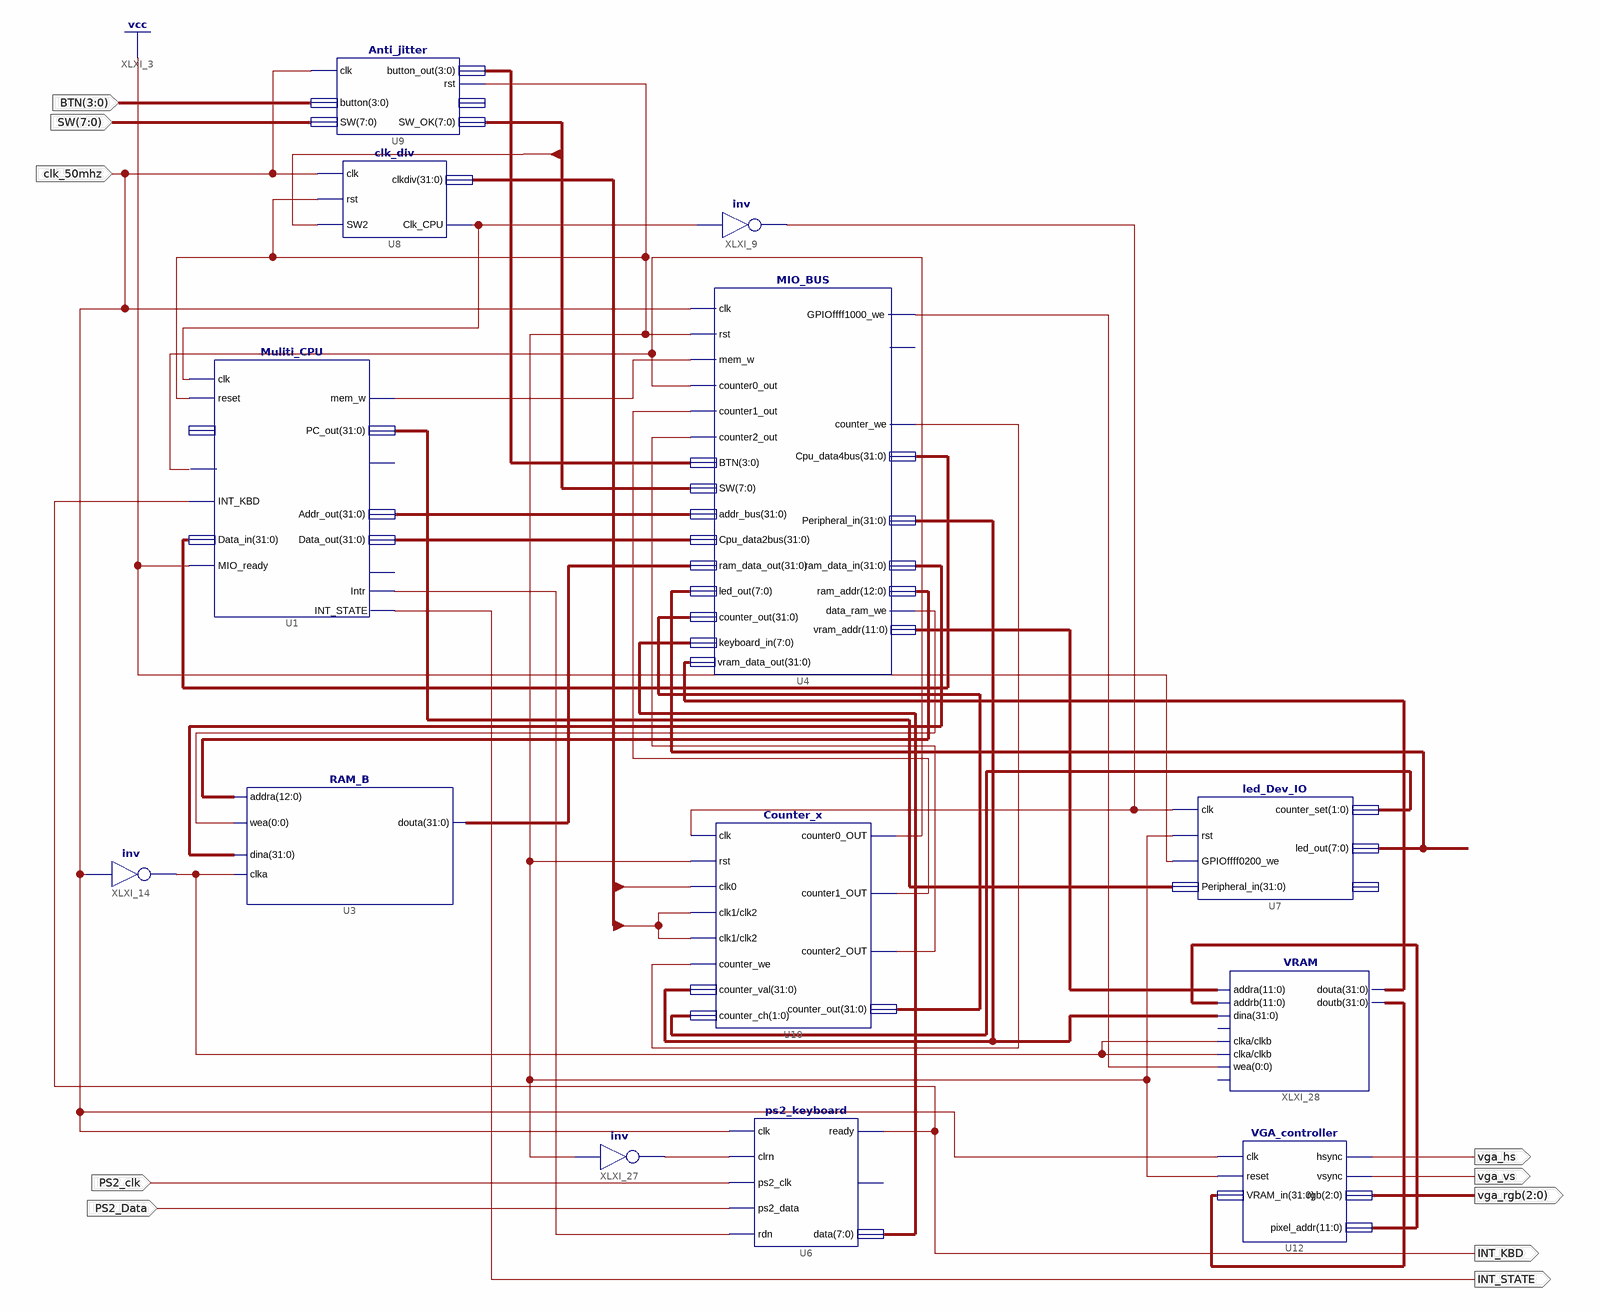
[diagram p0: schematic sheet 1]
// Xilinx ISE schematic Top_SCPU_IOBUS_App.sch (spartan3e) as structural Verilog: 13 symbols, 10 ports
module Top_SCPU_IOBUS_App (
  input  [3:0] BTN,
  input  [7:0] SW,
  input  clk_50mhz,
  input  PS2_clk,
  input  PS2_Data,
  output vga_hs,
  output vga_vs,
  output [2:0] vga_rgb,
  output INT_STATE,
  output INT_KBD
);

  wire Clk_CPU, clka, counter1_out, counter2_out, counter_we, GPIOffff1000_we, INT_CNT, intr, mem_w, rst,
       XLXN_55, XLXN_193;
  wire [0:0] XLXN_191;
  wire [1:0] counter_set;
  wire [3:0] button_out;
  wire [7:0] keyboard_in, LED, SW_OK;
  wire [11:0] vram_addr, vram_addr_ctr;
  wire [12:0] ram_addr;
  wire [31:0] Addr_out, clkdiv, counter_out, Cpu_data2bus, Data_in, PC_out, Peripheral_in, ram_data_in,
       ram_data_out, vram_data_out, vram_to_ctr;

  Anti_jitter U9 (
    .clk(clk_50mhz), .SW(SW), .button_out(button_out), .SW_OK(SW_OK), .button(BTN), .rst(rst));  // open: button_pulse
  clk_div U8 (.clk(clk_50mhz), .rst(rst), .SW2(SW_OK[2]), .clkdiv(clkdiv), .Clk_CPU(Clk_CPU));
  Counter_x U10 (
    .clk(XLXN_55), .rst(rst), .clk0(clkdiv[7]), .clk1(clkdiv[10]), .clk2(clkdiv[10]),
    .counter_we(counter_we), .counter_val(Peripheral_in), .counter_ch(counter_set), .counter0_OUT(INT_CNT),
    .counter1_OUT(counter1_out), .counter2_OUT(counter2_out), .counter_out(counter_out));
  not XLXI_9 (XLXN_55, Clk_CPU);
  RAM_B U3 (.addra(ram_addr), .clka(clka), .wea(XLXN_191[0]), .dina(ram_data_in), .douta(ram_data_out));
  not XLXI_14 (clka, clk_50mhz);
  MIO_BUS U4 (
    .clk(clk_50mhz), .rst(rst), .mem_w(mem_w), .counter0_out(INT_CNT), .counter1_out(counter1_out),
    .counter2_out(counter2_out), .BTN(button_out), .SW(SW_OK), .ram_data_out(ram_data_out), .led_out(LED),
    .counter_out(counter_out), .counter_we(counter_we), .ram_data_in(ram_data_in), .data_ram_we(XLXN_191[0]),
    .ram_addr(ram_addr), .Cpu_data4bus(Data_in), .Peripheral_in(Peripheral_in), .Cpu_data2bus(Cpu_data2bus),
    .addr_bus(Addr_out), .keyboard_in(keyboard_in), .GPIOffff1000_we(GPIOffff1000_we), .vram_addr(vram_addr),
    .vram_data_out(vram_data_out));  // open: GPIOffff0200_we
  Muliti_CPU U1 (
    .clk(Clk_CPU), .INT_CNT(INT_CNT), .reset(rst), .MIO_ready(1'b1), .Data_in(Data_in), .mem_w(mem_w),
    .PC_out(PC_out), .Addr_out(Addr_out), .Data_out(Cpu_data2bus), .INT_KBD(INT_KBD), .Intr(intr),
    .INT_STATE(INT_STATE));  // open: inst_out, CPU_MIO, state
  led_Dev_IO U7 (
    .clk(XLXN_55), .rst(rst), .GPIOffff0200_we(1'b1), .Peripheral_in(PC_out), .counter_set(counter_set),
    .led_out(LED));  // open: GPIOf0
  VGA_controller U12 (
    .hsync(vga_hs), .clk(clk_50mhz), .reset(rst), .vsync(vga_vs), .rgb(vga_rgb), .pixel_addr(vram_addr_ctr),
    .VRAM_in(vram_to_ctr));
  ps2_keyboard U6 (
    .clk(clk_50mhz), .clrn(XLXN_193), .ps2_clk(PS2_clk), .ps2_data(PS2_Data), .rdn(intr), .ready(INT_KBD),
    .data(keyboard_in));  // open: overflow
  not XLXI_27 (XLXN_193, rst);
  VRAM XLXI_28 (
    .addra(vram_addr), .addrb(vram_addr_ctr), .dina(Peripheral_in), .clka(clka), .clkb(clka),
    .wea(GPIOffff1000_we), .douta(vram_data_out), .doutb(vram_to_ctr));  // open: dinb, web
endmodule
